# EAGLE design Logic (EAGLE 8.3.2)
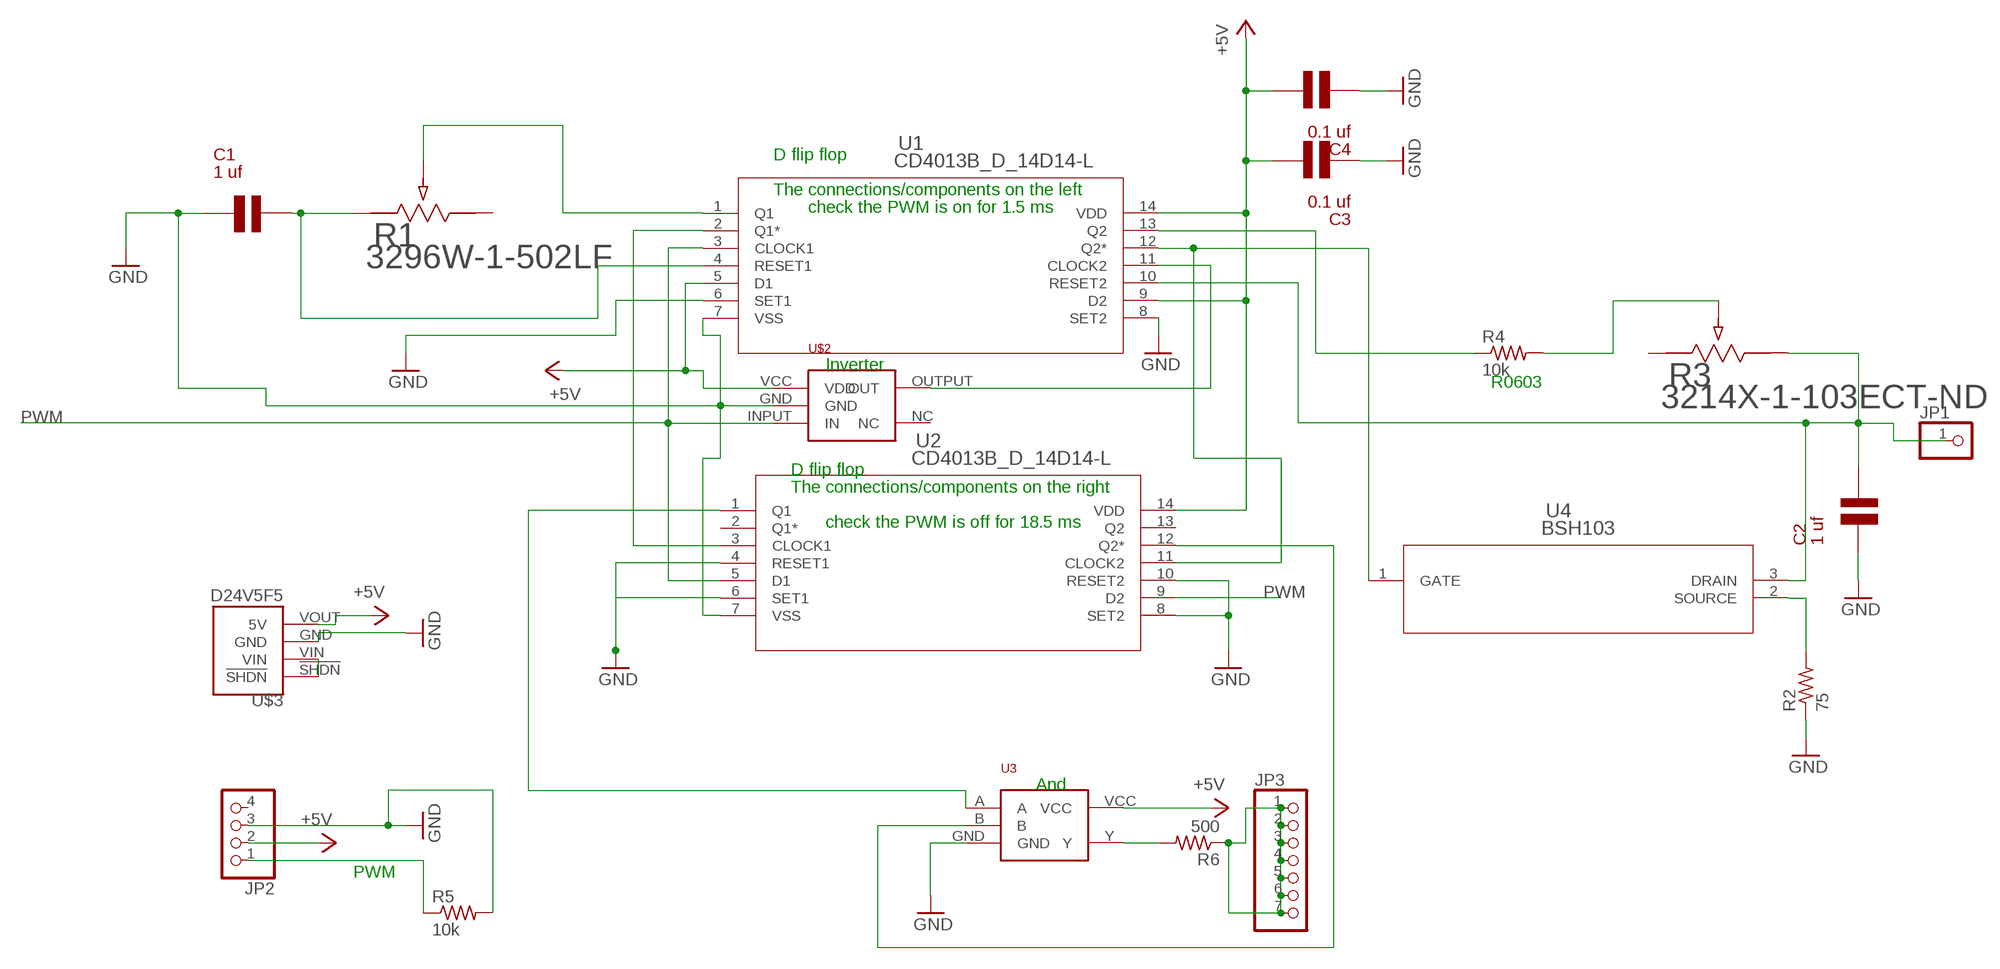
[diagram p0: schematic, sheet 1]

## Parts
C1  1 uf  CER-CAP  [X7R0805]
C2  1 uf  CER-CAP  [X7R0805]
C3  0.1 uf  CER-CAP  [X7R0805]
C4  0.1 uf  CER-CAP  [X7R0805]
JP1  PINHD-1X1  [1X01]
JP2  PINHD-1X4  [1X04]
JP3  PINHD-1X7  [1X07]
R1  3296W-1-502LF  [POT_3296W]
R2  75  R-US_R0603  [R0603]
R3  3214X-1-103ECT-ND  [POT_3214X]
R4  10k  R-US_R0603  [R0603]
R5  10k  R-US_R0603  [R0603]
R6  500  R-US_R0603  [R0603]
U1  CD4013B_D_14D14-L  [D14-L]
U2  CD4013B_D_14D14-L  [D14-L]
U3  NC7SZ08-AND  [NC7S04-SOT23]
U4  BSH103  [SOT23]
U$2  NCS704-INVERTER  [NC7S04-SOT23]
U$3  D24V5F5  [D24V5FX_FLAT_THIN_R]

## Nets
+5V: C3.2 C4.2 JP2.2 U1.5(D1) U1.9(D2) U1.14(VDD) U2.14(VDD) U3.VCC U$2.VCC(VDD) U$3.VOUT(5V)
GND: C1.1 C2.1 C3.1 C4.1 JP2.3 R2.1 R5.2 U1.6(SET1) U1.7(VSS) U1.8(SET2) U2.4(RESET1) U2.6(SET1) U2.7(VSS) U2.8(SET2) U2.10(RESET2) U3.GND U$2.GND U$3.GND
N$1: R3.WIPER R4.2
N$2: C1.2 R1.1 U1.4(RESET1)
N$3: U1.11(CLOCK2) U$2.OUTPUT(OUT)
N$4: U1.2(Q1*) U2.3(CLOCK1)
N$5: R4.1 U1.13(Q2)
N$6: R1.2 U1.1(Q1)
N$7: C2.2 JP1.1 R3.CW U1.10(RESET2) U4.3(DRAIN)
N$8: JP3.1 JP3.2 JP3.3 JP3.4 JP3.5 JP3.6 JP3.7 R6.1
N$9: U1.12(Q2*) U2.11(CLOCK2) U4.1(GATE)
N$10: U2.1(Q1) U3.A
N$11: U2.12(Q2*) U3.B
N$12: R6.2 U3.Y
N$13: U$3.!SHDN U$3.VIN
N$14: R2.2 U4.2(SOURCE)
PWM: JP2.1 R5.1 U1.3(CLOCK1) U2.5(D1) U2.9(D2) U$2.INPUT(IN)
Unconnected: JP2.4 R1.3 R3.CCW U2.2(Q1*) U2.13(Q2) U$2.NC

## Notes on the sheet
- D flip flop
- The connections/components on the left
- check the PWM is on for 1.5 ms
- Inverter
- R0603
- D flip flop
- The connections/components on the right
- check the PWM is off for 18.5 ms
- And
- PWM

## Library data of the parts
C1-C4 = Capacitor:CER-CAP
JP1 = pinhead:PINHD-1X1: PIN HEADER
JP2 = pinhead:PINHD-1X4: PIN HEADER
JP3 = pinhead:PINHD-1X7: PIN HEADER
R1 = POT:3296W-1-502LF; MANUFACTURER_PART_NUMBER: 3296W1502LF; VENDOR: Bourns Electronics
R2 R4-R6 = resistor:R-US_: RESISTOR, American symbol
R3 = POT:3214X-1-103ECT-ND
U1 U2 = CD4013B:CD4013B_D_14
U3 = AND:NC7SZ08-AND
U4 = NMOS:BSH103; MANUFACTURER_PART_NUMBER: BSH103; VENDOR: NXP
U$2 = Inverter:NCS704-INVERTER
U$3 = Pololu-Step-Down:D24V5F5

## Board
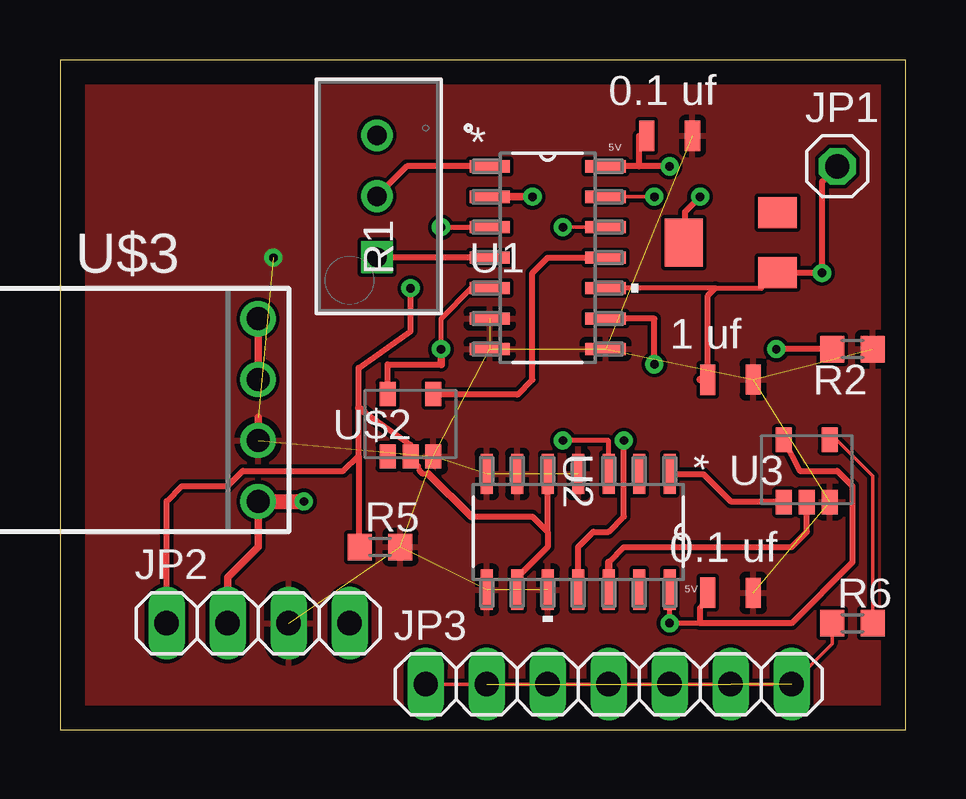
[diagram p1: board, top side]
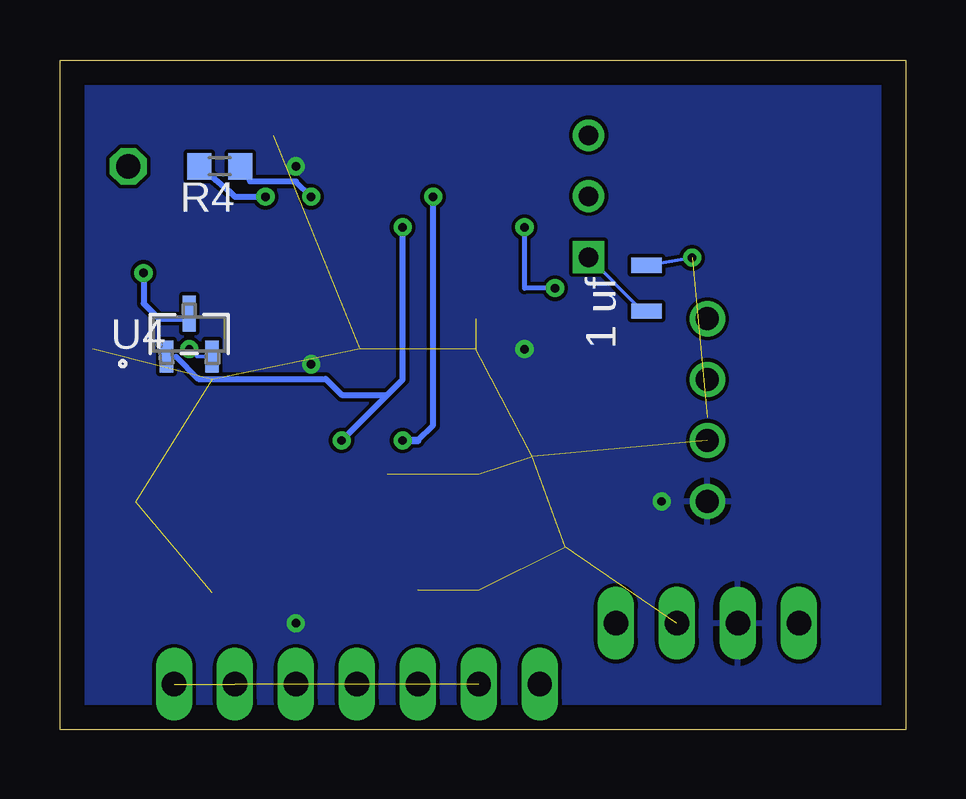
[diagram p2: board, bottom side, seen from below]

Size 35.23 x 27.93 mm. Coordinates in mm from the lower left corner, seen from the top.
Outline: 0,0 35.23,0 35.23,27.93 0,27.93 0,0
Copper layers (1*16): Top 0.035mm / dielectric 1.5mm / Bottom 0.035mm
Design rules "default": minimum track width 6mil, minimum drill 0.35mm, track to track 6mil, track to pad 6mil, pad to pad 6mil, via to via 6mil, smd to smd 6mil, copper to edge 40mil, drill to drill 6mil, minimum pad ring 10mil, minimum via ring 8mil, stop-mask expansion 4mil, vias tented up to drill 0mil, thermal gap 10mil

### Footprints (pad centres in the part's own frame; a part is rotated, then mirrored left to right if it is on the bottom)
X7R0805 = smd 0.635 x 1.26: 1 0.95,0 | smd 0.635 x 1.27: 2 -0.95,0
1X01 = drill 1.016 octagon: 1 0,0
1X04 = drill 1.016 long: 1 -3.81,0; 2 -1.27,0; 3 1.27,0; 4 3.81,0
1X07 = drill 1.016 long: 1 -7.62,0; 2 -5.08,0; 3 -2.54,0; 4 0,0; 5 2.54,0; 6 5.08,0; 7 7.62,0
POT_3296W = drill 0.813 pad 1.321 square: 1 -5.055,0.127 | drill 0.813 pad 1.321: 2 -2.515,0.127; 3 0.025,0.127
R0603 = smd 1 x 1.1: 1 -0.85,0; 2 0.85,0
POT_3214X = smd 1.6 x 1.3: CCW 1.95,1.25; CW 1.95,-1.25 | smd 1.6 x 2: WIPER -1.95,0
D14-L = smd 1.676 x 0.508: 1 -2.413,3.81; 2 -2.413,2.54; 3 -2.413,1.27; 4 -2.413,0; 5 -2.413,-1.27; 6 -2.413,-2.54; 7 -2.413,-3.81; 8 2.413,-3.81; 9 2.413,-2.54; 10 2.413,-1.27; 11 2.413,0; 12 2.413,1.27; 13 2.413,2.54; 14 2.413,3.81
NC7S04-SOT23 = smd 0.7 x 1: A -0.95,-1.3; B 0,-1.3; GND 0.95,-1.3; VCC -0.95,1.3; Y 0.95,1.3
SOT23 = smd 0.559 x 1.321: 1 -0.953,-0.945; 2 0.953,-0.945 | smd 0.559 x 1.517: 3 0,0.847
NC7S04-SOT23' = smd 0.7 x 1: GND 0.95,-1.3; INPUT 0,-1.3; NC -0.95,-1.3; OUTPUT 0.95,1.3; VCC -0.95,1.3
D24V5FX_FLAT_THIN_R = drill 0.965: !SHDN 1.27,3.81; GND 1.27,-1.27; VIN 1.27,1.27; VOUT 1.27,-3.81

### Placement (x,y rotation side)
C1  10.79,18.41 90 bottom
C2  27.94,14.61 0 top
C3  25.4,24.77 0 top
C4  27.94,5.71 0 top
JP1  32.38,23.5 0 top
JP2  8.25,4.45 0 top
JP3  22.86,1.9 0 top
R1  13.33,24.77 90 top
R2  33.02,15.88 180 top
R3  27.94,20.32 0 top
R4  28.57,23.5 180 bottom
R5  13.33,7.62 0 top
R6  33.02,4.45 0 top
U1  20.32,19.68 0 top
U2  21.59,8.25 270 top
U3  31.11,10.79 0 top
U4  29.85,16.51 0 bottom
U$2  NCS704-INVERTER  [NC7S04-SOT23']  14.6,12.7 0 top
U$3  6.98,13.34 0 top

### Tracks (layer width: path | path; a pad name or v marks a point on that pad's centre or on a via)
+5V  (via drill 0.35)
  Top 0.152: 17.14,18.41 U1.5
  Top 0.203: U2.14 v25.4,4.45 26.67,4.45 | v15.87,15.88 15.87,17.14 17.14,18.41 | 24.13,24.77 C3.2 | 26.67,5.08 C4.2
  Top 0.254: U3.VCC 30.83,10.79 32.38,10.79 33.02,10.16 33.02,6.98 30.48,4.45 26.67,4.45 26.67,5.08 | v25.4,23.5 24.13,23.5 | 24.13,23.5 U1.14 | v24.77,15.24 24.77,17.14 U1.9 | U$2.VCC 13.65,15.24 15.87,15.24 | 24.13,23.5 24.13,24.77
  Top 0.305: 15.87,15.24 v15.87,15.88 | JP2.2 6.98,6.35 8.25,7.62 U$3.VOUT
  Top 0.635: U$3.VOUT v10.16,9.53
  pour Bottom: 0,0 0,27.3 34.92,27.3 34.92,0
GND  (via drill 0.35)  (17 unrouted)
  Top 0.305: U$3.GND 8.25,13.02
  Bottom 0.152: C1.1 v8.89,19.68
  pour Top: 0,28.58 34.92,27.94 34.92,0 0,0
N$1  (via drill 0.35)
  Top 0.152: 26.04,20.36 R3.WIPER
  Top 0.254: v26.67,22.23 26.04,21.59 26.04,20.36
  Bottom 0.254: R4.2 28.16,22.44 27.94,22.23 v26.67,22.23
N$2
  Top 0.152: 17.88,19.71 U1.4
  Top 0.254: R1.1 17.88,19.71
  Bottom 0.152: C1.2 10.96,17.46 R1.1
N$3
  Top 0.254: U1.11 20.32,19.68 19.69,19.05 19.69,15.24 19.69,14.61 19.05,13.97 19.02,14 U$2.OUTPUT
N$4  (via drill 0.35)
  Top 0.203: U2.3 22.86,12.07 v20.96,12.07
  Top 0.305: v19.69,22.23 U1.2
  Bottom 0.254: 20.32,12.07 19.69,12.7 v19.69,22.23
  Bottom 0.305: v20.96,12.07 20.32,12.07
N$5  (via drill 0.35)
  Top 0.152: U1.13 v24.77,22.23
  Bottom 0.203: 27.3,22.86 R4.1
  Bottom 0.254: v24.77,22.23 25.4,22.86 27.3,22.86
N$6
  Top 0.254: R1.2 14.45,23.5 U1.1
N$7  (via drill 0.35)
  Top 0.152: 29.24,18.41 R3.CW | 31.73,19.07 v31.75,19.05
  Top 0.203: 29.24,18.41 27.3,18.41 U1.10
  Top 0.254: R3.CW 31.73,19.07 | v31.75,19.05 31.75,22.86 JP1.1 | C2.2 26.99,18.1 27.3,18.41
  Top 0.305: 26.67,14.61 C2.2
  Bottom 0.152: 30.06,17.14 U4.3
  Bottom 0.254: v31.75,19.05 31.75,17.78 31.11,17.14 30.06,17.14
N$8  (5 unrouted)
  Top 0.152: JP3.1 JP3.7 32.17,3.59 R6.1
N$9  (via drill 0.35)
  Top 0.152: v20.96,20.95 U1.12
  Top 0.254: U2.11 21.59,7.62 22.23,8.25 22.86,8.25 23.5,8.89 v23.5,12.07
  Bottom 0.152: U4.1 30.39,15.57
  Bottom 0.254: v20.96,20.95 20.96,14.61 21.59,13.97 | 21.59,13.97 v23.5,12.07 | 30.39,15.57 29.46,14.63 24.16,14.63 23.5,13.97 21.59,13.97
N$10
  Top 0.152: 25.4,10.79 U2.1
  Top 0.254: U2.1 26.8,10.67 27.94,9.53 30.14,9.53 U3.A
N$11
  Top 0.254: 22.86,6.98 23.5,7.62 30.48,7.62 31.11,8.25 U3.B
  Top 0.305: U2.12 22.86,6.98
N$12
  Top 0.152: R6.2 33.87,10.58 32.38,12.07 32.09,12.07 U3.Y
N$13
  Top 0.305: U$3.!SHDN U$3.VIN
N$14  (via drill 0.35)
  Top 0.254: R2.2 v29.85,15.88
  Bottom 0.152: U4.2 29.54,15.57 v29.85,15.88
PWM  (via drill 0.35)
  Top 0.152: U2.9 19.05,6.35 | U2.5 20.32,9.53 | 14.98,10.82 14.98,11.03 U$2.INPUT 14.6,11.89 | 15.12,10.67 15.34,10.67 | 12.58,13.34 12.65,13.27
  Top 0.203: v15.87,20.95 U1.3 | 12.44,7.66 R5.1
  Top 0.254: 19.05,6.35 20.32,7.62 20.32,8.25 | 20.32,8.25 U2.5 | 14.98,10.82 15.12,10.67 | 12.65,13.27 14.6,11.89 | v14.6,18.41 14.6,16.62 12.44,15.09 12.44,13.42 12.44,11.43 | JP2.1 4.45,9.53 5.08,10.16 6.98,10.16 7.62,10.79 11.81,10.79 12.44,11.43 | 12.44,11.43 12.44,7.66 | 20.32,8.25 19.69,8.89 17.14,8.89
  Top 0.305: 15.34,10.67 17.14,8.89 | 12.65,13.27 12.44,13.42
  Bottom 0.203: v15.87,20.95 15.87,18.41 v14.6,18.41

### Text on the board
tSilk: 5V | 5V